# Altium schematic sheet pwr_system.SchDoc
size A4; Revision: A
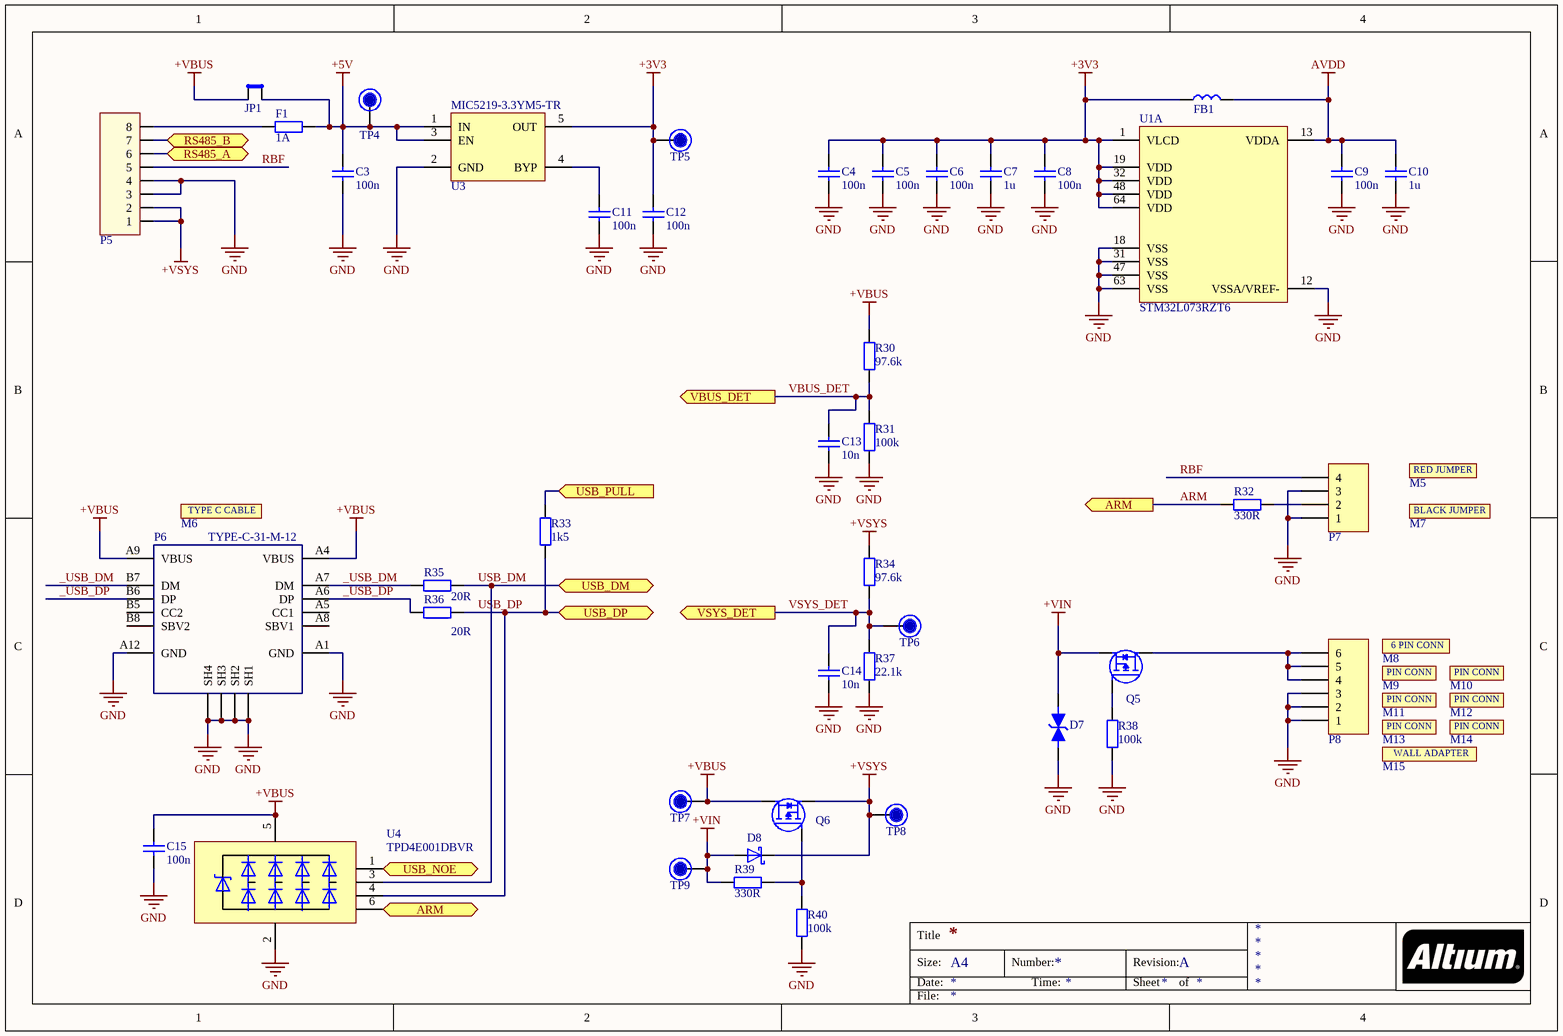
[diagram p0: pwr_system.SchDoc]

## Parts
C3  100n  [C0603_IPC_MD]
C4  100n  [C0603_IPC_MD]
C5  100n  [C0603_IPC_MD]
C6  100n  [C0603_IPC_MD]
C7  1u  [C0603_IPC_MD]
C8  100n  [C0603_IPC_MD]
C9  100n  [C0603_IPC_MD]
C10  1u  [C0603_IPC_MD]
C11  100n  [C0603_IPC_MD]
C12  100n  [C0603_IPC_MD]
C13  10n  [C0603_IPC_MD]
C14  10n  [C0603_IPC_MD]
C15  100n  [C0603_IPC_MD]
D7  824501121  [DIOM4227X25N]  (value not drawn)
D8  B540C-13-F  [DO-214AB(SMC)]  (value not drawn)
F1  1A  [R0603_IPC_MD]
FB1  MH1608-601Y  [L0603_IPC_MD]  (value not drawn)
JP1  Jumper  [SolderHump1]  (value not drawn)  (no BOM)
M5  2-881545-2  (value not drawn)  (mechanical)
M6  UGREEN-PVC-TYPE-C  (value not drawn)  (mechanical)
M7  STC02SYAN  (value not drawn)  (mechanical)
M8  M20-1060600  (value not drawn)  (mechanical)
M9  M20-1160042  (value not drawn)  (mechanical)
M10  M20-1160042  (value not drawn)  (mechanical)
M11  M20-1160042  (value not drawn)  (mechanical)
M12  M20-1160042  (value not drawn)  (mechanical)
M13  M20-1160042  (value not drawn)  (mechanical)
M14  M20-1160042  (value not drawn)  (mechanical)
M15  SWI10-12-E-P5  (value not drawn)  (mechanical)
P5  PicoBlade_8V  [PB_53398-0871]  (value not drawn)
P6  TYPE-C-31-M-12  [TYPE-C-C165948]
P7  A2541WR-4P  [PLS-1-4]  (value not drawn)
P8  A2541WR-6P  [PLS-1-6]  (value not drawn)
Q5  SISH625DN-T1-GE3  [SISH625DN]  (value not drawn)
Q6  SISH625DN-T1-GE3  [SISH625DN]  (value not drawn)
R30  97.6k  [R0603_IPC_MD]
R31  100k  [R0603_IPC_MD]
R32  330R  [R0603_IPC_MD]
R33  1k5  [R0603_IPC_MD]
R34  97.6k  [R0603_IPC_MD]
R35  20R  [R0805_IPC_MD]
R36  20R  [R0805_IPC_MD]
R37  22.1k  [R0603_IPC_MD]
R38  100k  [R0603_IPC_MD]
R39  330R  [R0603_IPC_MD]
R40  100k  [R0603_IPC_MD]
TP4  5V  [TestPoint_1M5]  (value not drawn)  (no BOM)
TP5  3V3  [TestPoint_1M5]  (value not drawn)  (no BOM)
TP6  VADC  [TestPoint_1M5]  (value not drawn)  (no BOM)
TP7  VBUS  [TestPoint_1M5]  (value not drawn)  (no BOM)
TP8  VSYS  [TestPoint_1M5]  (value not drawn)  (no BOM)
TP9  VIN  [TestPoint_1M5]  (value not drawn)  (no BOM)
U1  STM32L073RZT6  [LQFP64_10X10MM]  (part A of 2)
U3  MIC5219-3.3YM5-TR  [SOT23-5_(MT)]
U4  TPD4E001DBVR  [SOT23-6]

## Ports
ARM (in), ARM (out), RS485_A (bidir), RS485_B (bidir), USB_DM (bidir), USB_DP (bidir), USB_NOE (in), USB_PULL (in), VBUS_DET (out), VSYS_DET (out)

## Nets
+3V3: C4.2 C5.2 C6.2 C7.2 C8.2 C12.1 FB1.1 TP5.0 U1.1(VLCD) U1.19(VDD) U1.32(VDD) U1.48(VDD) U1.64(VDD) U3.5(OUT)
+5V: C3.1 F1.2 JP1.2 TP4.0 U3.1(IN) U3.3(EN)
+VBUS: C15.2 JP1.1 P6.A4(VBUS) P6.A9(VBUS) Q6.3(D) R30.2 TP7.0 U4.5(VCC)
+VIN: D7.2 D8.2(A) Q5.1(S) R39.2 TP9.0
+VSYS: D8.1(C) P5.1 P5.2 Q6.1(S) R34.2 TP8.0
AVDD: C9.2 C10.2 FB1.2 U1.13(VDDA)
GND: C3.2 C4.1 C5.1 C6.1 C7.1 C8.1 C9.1 C10.1 C11.2 C12.2 C13.1 C14.1 C15.1 D7.1 P5.3 P5.4 P6.A1(GND) P6.A12(GND) P6.SH1 P6.SH2 P6.SH3 P6.SH4 P7.1 P7.3 P8.1 P8.2 P8.3 R31.2 R37.1 R38.2 R40.2 U1.12(VSSA/VREF-) U1.18(VSS) U1.31(VSS) U1.47(VSS) U1.63(VSS) U3.2(GND) U4.2(GND)
_USB_DM: P6.A7(DM) P6.B7(DM) R35.1
_USB_DP: P6.A6(DP) P6.B6(DP) R36.1
ARM: R32.1 U4.6(IO4) ; port ARM
RBF: P5.5 P7.4
RS485_A: P5.6 ; port RS485_A
RS485_B: P5.7 ; port RS485_B
USB_DM: R35.2 U4.3(IO2) ; port USB_DM
USB_DP: R33.1 R36.2 U4.4(IO3) ; port USB_DP
USB_NOE: U4.1(IO1) ; port USB_NOE
USB_PULL: R33.2 ; port USB_PULL
VBUS_DET: C13.2 R30.1 R31.1 ; port VBUS_DET
VSYS_DET: C14.2 R34.1 R37.2 TP6.0 ; port VSYS_DET
NetC11_1: C11.1 U3.4(BYP)
NetF1_1: F1.1 P5.8
NetP7_2: P7.2 R32.2
NetP8_4: P8.4 P8.5 P8.6 Q5.3(D)
NetQ5_2: Q5.2(G) R38.1
NetQ6_2: Q6.2(G) R39.1 R40.1

Not connected (* = marked no-connect by the designer): P6 A5(CC1) A8(SBV1) B5(CC2) B8(SBV2)

## Notes on the sheet
- Title
- Size:
- Date:
- A4
- Number:
- Time:
- Revision:
- Sheet
- of
- File:
- (in symbol 2-881545-2) RED JUMPER
- (in symbol M20-1060600) 6 PIN CONN
- (in symbol M20-1160042) PIN CONN
- (in symbol STC02SYAN) BLACK JUMPER
- (in symbol SWI10-12-E-P5) WALL ADAPTER
- (in symbol TYPE-C-CABLE) TYPE C CABLE

## Library data of the parts
C3-C6 C8 C9 C11 C12 C15 = CL10B104KO8NNNC: CAP CER 0.1UF 16V X7R 0603; Manufacturer: Samsung Electro-Mechanics; Manufacturer Part Number: CL10B104KO8NNNC; Voltage: 16V; Value: 100n; Dielectric: X7R; Supplier 1: Digi-Key; Supplier Part Number 1: 1276-1005-1-ND
C7 C10 = CL10B105MO8NNWC: CAP CER 1UF 16V X7R 0603; Manufacturer: Samsung Electro-Mechanics; Manufacturer Part Number: CL10B105MO8NNWC; Voltage: 16V; Value: 1u; Dielectric: X7R; Supplier 1: Digi-Key; Supplier Part Number 1: 1276-6524-1-ND
C13 C14 = CL10B103KB8NNNC: CAP CER 0.01UF 50V X7R 0603; Manufacturer: Samsung Electro-Mechanics; Manufacturer Part Number: CL10B103KB8NNNC; Voltage: 50V; Value: 10n; Dielectric: X7R; Supplier 1: Digi-Key; Supplier Part Number 1: 1276-1009-1-ND
D7 = 824501121_TVS: TVS DIODE 12V 19.9V DO214AC; Manufacturer: Wurth Electronics Inc.; Voltage - Reverse Standoff (Typ): 12V (Max); Current - Average Rectified (Io): 1A; Manufacturer Part Number: 824501121; Supplier 1: Digi-Key; Supplier Part Number 1: 732-9949-1-ND
D8 = B540C-13-F: DIODE SCHOTTKY 40V 5A DO214AB; Manufacturer: Diodes Inc.; Manufacturer Part Number: B540C-13-F; Supplier 1: Digi-Key; Supplier Part Number 1: B540C-FDICT-ND; Current: 5A
F1 = MFU0603FF01000P500: FUSE BOARD MOUNT 1A 32VDC 0603; Manufacturer: Bourns Inc.; Value: 1A; Manufacturer Part Number: MFU0603FF01000P500; Supplier 1: Digi-Key; Supplier Part Number 1: 749-1742-1-ND
FB1 = MH1608-601Y: FERRITE BEAD 600R@100MHz 0603 for Power Line, 1000mA; Manufacturer: Bourns Inc.; Manufacturer Part Number: MH1608-601Y; Supplier 1: Digi-Key; Supplier Part Number 1: MH1608-601YCT-ND
JP1 = Jumper: Jumper 2.54mm 1 pos; Manufacturer: *; Manufacturer Part Number: *
M5 = 2-881545-2: CONN POST SHUNT NOVO 2POS; Manufacturer: Sullins Connector Solutions; Manufacturer Part Number: 2-881545-2; Supplier 1: Digi-Key; Supplier Part Number 1: 2-881545-2-ND
M6 = TYPE-C-CABLE: Ugreen USB Type C Cable; Manufacturer: China; Manufacturer Part Number: UGREEN-PVC-TYPE-C; Supplier 1: Aliexpress; Supplier Part Number 1: UGREEN-PVC-TYPE-C; Link: https://www.aliexpress.com/item/32421088643.html?spm=2114.12010612.8148356.8.24b5310anwdN5o
M7 = STC02SYAN: CONN JUMPER SHORTING TIN; Manufacturer: Sullins Connector Solutions; Manufacturer Part Number: STC02SYAN; Supplier 1: Digi-Key; Supplier Part Number 1: S9000-ND
M8 = M20-1060600: CONN RCPT HSG 6POS 2.54MM; Manufacturer: Harwin Inc.; Manufacturer Part Number: M20-1060600; Supplier 1: Digi-Key; Supplier Part Number 1: 952-2231-ND
M9-M14 = M20-1160042: CONN SOCKET 22-30AWG CRIMP GOLD; Manufacturer: Harwin Inc.; Manufacturer Part Number: M20-1160042; Supplier 1: Digi-Key; Supplier Part Number 1: 952-2157-1-ND
M15 = SWI10-12-E-P5: AC/DC WALL MOUNT ADAPTER 12V 10W; Manufacturer: CUI Inc.; Manufacturer Part Number: SWI10-12-E-P5; Supplier 1: Digi-Key; Supplier Part Number 1: 102-4135-ND
P5 = PicoBlade_8V: Connector Header Surface Mount, Right Angle 8 position 0.049" (1.25mm); Manufacturer: China; Manufacturer Part Number: PicoBlade_8V; Supplier 1: Aliexpress; Supplier Part Number 1: PicoBlade_8V
P6 = TYPE-C-31-M-12: TYPE C PCB TH CONN; Manufacturer: Korean Hroparts Elec; Manufacturer Part Number: TYPE-C-31-M-12; Supplier 1: LCSC; Supplier Part Number 1: C165948
P7 = A2541WR-4P: Pin Header / Female Header 0.100"（2.54mm） Plugin P=2.54mm RoHS; Manufacturer: Changjiang Connectors; Manufacturer Part Number: A2541WR-4P; Supplier 1: LCSC; Supplier Part Number 1: C225490
P8 = A2541WR-6P: Pin Header / Female Header 0.100"（2.54mm） Plugin P=2.54mm RoHS; Manufacturer: Changjiang Connectors; Manufacturer Part Number: A2541WR-6P; Supplier 1: LCSC; Supplier Part Number 1: C225492
Q5 Q6 = SISH625DN-T1: P-Channel 30V 17.3A (Ta), 35A (Tc) 3.7W (Ta), 52W (Tc) Surface Mount PowerPAK® 1212-8SH; Manufacturer: Vishay Siliconix; Manufacturer Part Number: SISH625DN-T1-GE3; Supplier 1: Digi-Key; Supplier Part Number 1: SISH625DN-T1-GE3CT-ND
R30 R34 = RC0603FR-0797K6L: RES SMD 97.6K OHM 1% 1/10W 0603; Manufacturer: Yageo; Value: 97.6k; Tolarance: 1%; Manufacturer Part Number: RC0603FR-0797K6L; Supplier 1: Digi-Key; Supplier Part Number 1: 311-97.6KHRCT-ND
R31 R38 R40 = RMCF0603FT100K: RES 100K OHM 1% 1/10W 0603; Manufacturer: Bourns Inc.; Value: 100k; Tolarance: 1%; Manufacturer Part Number: RMCF0603FT100K; Supplier 1: Digi-Key; Supplier Part Number 1: RMCF0603FT100KCT-ND
R32 R39 = CR0603-JW-331ELF: RES SMD 330 OHM 5% 1/10W 0603; Manufacturer: Bourns Inc.; Value: 330R; Tolarance: 5%; Manufacturer Part Number: CR0603-JW-331ELF; Supplier 1: Digi-Key; Supplier Part Number 1: CR0603-JW-331ELFCT-ND
R33 = RC0603JR-071K5L: RES SMD 1.5K OHM 5% 1/10W 0603; Manufacturer: Yageo; Value: 1k5; Tolarance: 5%; Manufacturer Part Number: RC0603JR-071K5L; Supplier 1: Digi-Key; Supplier Part Number 1: 311-1.5KGRCT-ND
R35 R36 = RC0805JR-0720RL: RES SMD 20 OHM 5% 1/8W 0805; Manufacturer: Yageo; Value: 20R; Tolarance: 5%; Manufacturer Part Number: RC0805JR-0720RL; Supplier 1: Digi-Key; Supplier Part Number 1: 311-20ARDKR-ND
R37 = RC0603FR-0722K1L: RES SMD 22.1K OHM 1% 1/10W 0603; Manufacturer: Yageo; Value: 22.1k; Tolarance: 1%; Manufacturer Part Number: RC0603FR-0722K1L; Supplier 1: Digi-Key; Supplier Part Number 1: 311-22.1KHRCT-ND
TP4-TP9 = TP: Test Point
U1 = STM32L073RZT6: Ultra-low-power 32-bit MCU ARM®-based Cortex®-M0+; Manufacturer: ST; SRAM: 20KB; FLASH: 192KB; Manufacturer Part Number: STM32L073RZT6; Supplier 1: Digi-Key; Supplier Part Number 1: 497-16270-ND
U3 = MIC5219-3.3YM5-TR: IC REG LINEAR 3.3V 500MA SOT23-5; Manufacturer: Microchip Technology; Manufacturer Part Number: MIC5219-3.3YM5-TR; Supplier 1: Digi-Key; Supplier Part Number 1: 576-1281-1-ND
U4 = TPD4E001DBVR: 4x TVS DIODE 5.5V SOT23-6; Manufacturer: TI; Manufacturer Part Number: TPD4E001DBVR; Supplier 1: Digi-Key; Supplier Part Number 1: 296-28203-1-ND